# Altium schematic sheet PowerRails.SchDoc
size A4
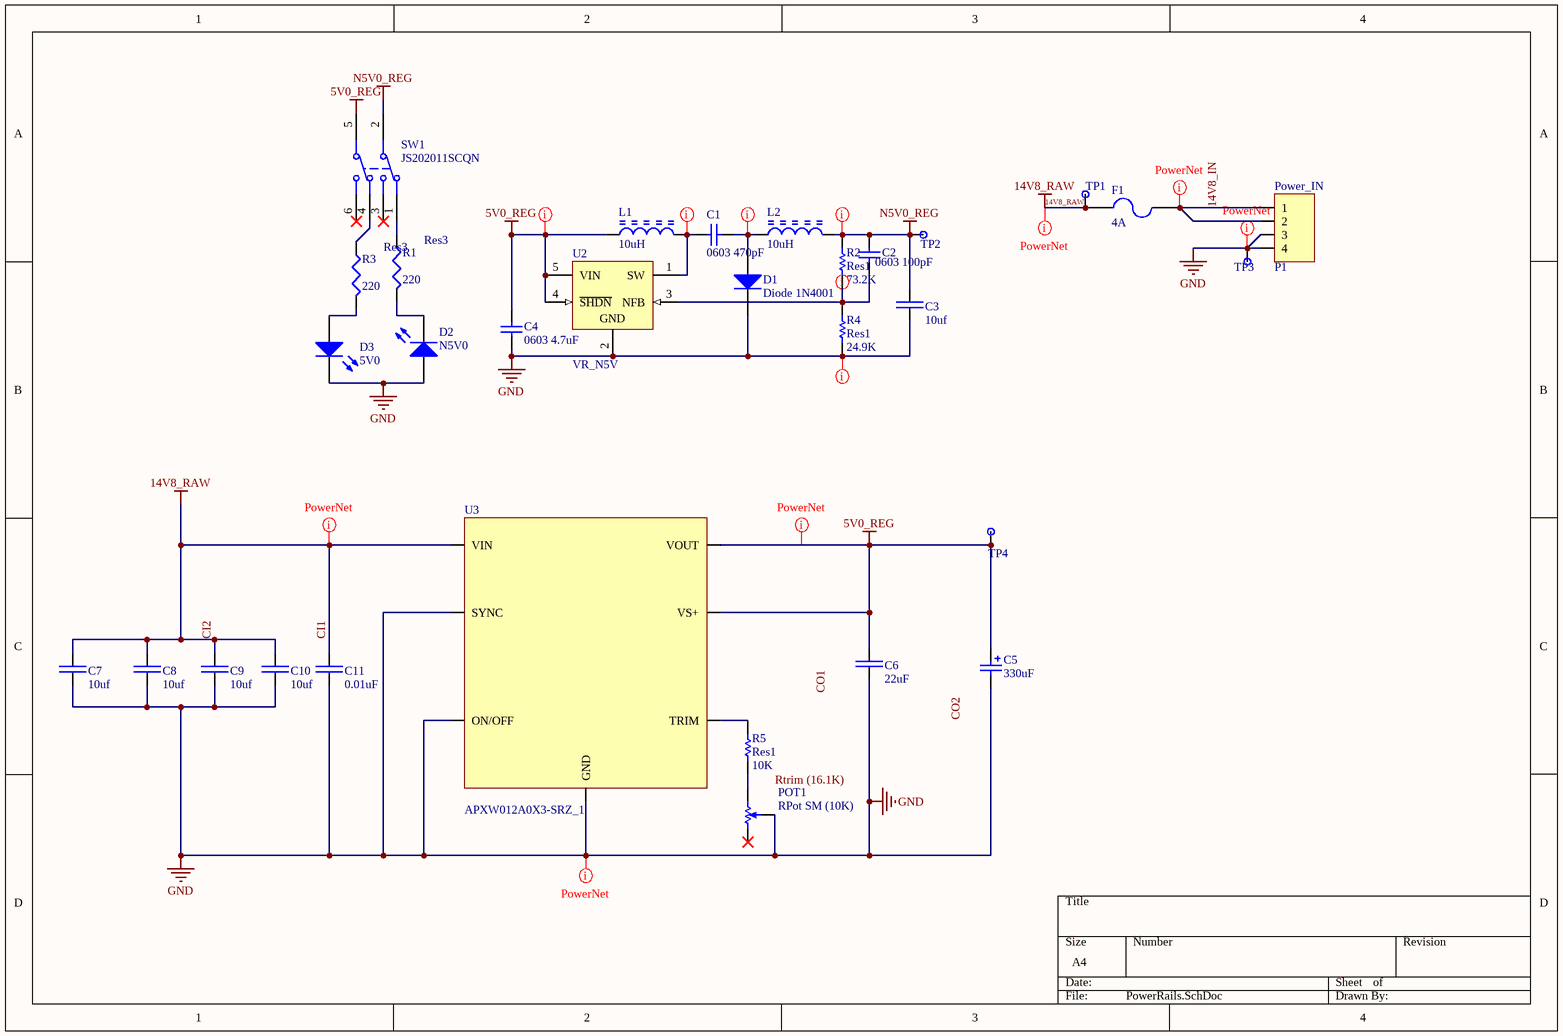
[diagram p0: PowerRails.SchDoc]

## Parts
C1  0603 470pF  [CAPC1608X90X35LL10T15]
C2  0603 100pF  [CAPC1608X90X35LL10T15]
C3  10uf  [10uF capacitor LPB]
C4  0603 4.7uF  [CAPC1608X90X35LL10T15]
C5  330uF  [330uF throught hole]
C6  22uF  [22uF Capacitor]
C7  10uf  [10uF capacitor LPB]
C8  10uf  [10uF capacitor LPB]
C9  10uf  [10uF capacitor LPB]
C10  10uf  [10uF capacitor LPB]
C11  0.01uF  [0.01uF capacitor]
D1  Diode 1N4001  [DO-41]
D2  N5V0  [LTST-C171TBKT]
D3  5V0  [LTST-C171TBKT]
F1  4A  [0157010.DR]
L1  10uH  [BOUR-CM322522_V]
L2  10uH  [BOUR-CM322522_V]
P1  Power_IN  [MOLEX 0039281043]
POT1  RPot SM (10K)  [POT4MM-2]
R1  Res3  value 220  [RESC1608X06N_0603]
R2  Res1  value 73.2K  [RESC1608X06N_0603]
R3  Res3  value 220  [RESC1608X06N_0603]
R4  Res1  value 24.9K  [RESC1608X06N_0603]
R5  Res1  value 10K  [RESC1608X06N_0603]
SW1  JS202011SCQN  [CKCP-JS202011SCQN-6_V]
TP1  5V0_REG  [50_MIL_PAD]  (value not drawn)
TP2  N5V0_REG  [50_MIL_PAD]  (value not drawn)
TP3  12V0_RAW  [50_MIL_PAD]  (value not drawn)
TP4  12V0_RAW  [50_MIL_PAD]  (value not drawn)
U2  VR_N5V  [LT-S5-5-SOT-23_L]
U3  APXW012A0X3-SRZ_1  [APXW012A0X3-SRZ]

## Nets
5V0_REG: C4.2 C5.1 C6.2 L1.1 SW1.5(COM) TP4.1 U2.4(~{SHDN}) U2.5(VIN) U3.3(VS+) U3.5(VOUT)
14V8_RAW: C7.2 C8.2 C9.2 C10.2 C11.2 F1.1 TP1.1 U3.7(VIN)  [also labelled CI1, CI2]
GND: C3.1 C4.1 C5.2 C6.1 C7.1 C8.1 C9.1 C10.1 C11.1 D1.2(K) D2.1(A) D3.2(K) P1.3 P1.4 POT1.W R4.1 TP3.1 U2.2(GND) U3.1(ON/OFF) U3.2(GND) U3.6(SYNC)
N5V0_REG: C2.2 C3.2 L2.2 R2.2 SW1.2(COM) TP2.1
14V8_IN: F1.2 P1.1 P1.2
NetC1_1: C1.1 L1.2 U2.1(SW)
NetC1_2: C1.2 D1.1(A) L2.1
NetC2_1: C2.1 R2.1 R4.2 U2.3(NFB)
NetD2_2: D2.2(K) R1.2
NetD3_1: D3.1(A) R3.2
NetPOT1_CW: POT1.CW(+) R5.1
NetR1_1: R1.1 SW1.1
NetR3_1: R3.1 SW1.4
NetR5_2: R5.2 U3.4(TRIM)

Not connected (* = marked no-connect by the designer): POT1 CCW(-)*; SW1 3* 6*

## Layout directives
net class PowerNet: 5V0_REG, 14V8_IN, 14V8_RAW, GND
rule Width Constraint [Pref Width = 15mil    Min Width = 15mil    Max Width = 15mil]: 5V0_REG, GND, N5V0_REG, NetC1_1, NetC1_2, NetC2_1

## Notes on the sheet
- Labels drawn without touching a wire or pin: CO1, CO2, Rtrim (16.1K)

## Library data of the parts
C1 C2 C4 = CMP-2006-02523-1: Part Number: GRM188R61E475KE11D; Manufacturer: Murata
C3 C7-C10 = GRT31CR61H106ME01L: CAP CER 10UF 50V X5R 1206; Manufacturer 1: Murata; Tolerance: 20%; Supplier 1: Digi-Key; Supplier Part Number 1: 490-12457-1-ND; Manufacturer Part Number 1: GRT31CR61H106ME01L; Stock 1: 8159; Pricing 1: 1=0,50000, 10=0,34900, 100=0,20920, 500=0,15690, 1000=0,13249 (USD); RoHS: Yes; Mount: Surface Mount; Case/Package: 1206; Case Code (Metric): 3216; Case Code (Imperial): 1206; Min Operating Temperature: -55°C; Max Operating Temperature: 85°C; Packaging: Tape and Reel; Capacitance: 10uF; Voltage Rating: 50V; Length: 0.126inch; Width: 0.063inch; Thickness: 0.071inch; Ratings: AEC-Q200; ComponentLink1URL: http://search.murata.co.jp/Ceramy/image/img/A01X/G101/ENG/GRT31CR61H106ME01-01.pdf?src-supplier=Digi-Key; ComponentLink1Description: http://search.murata.co.jp/Ceramy/image/img/A01X/G101/ENG/GRT31CR61H106ME01-01.pdf?src-supplier=Digi-Key; Category: Capacitor
C5 = 35ZLH330MEFCT810X12.5: CAP ALUM 330UF 20% 35V RADIAL; Manufacturer 1: Rubycon; Ripple Current: 731.5mA; Impedance: 39mR; Life (Hours): 10000Hour; Supplier 1: Digi-Key; Supplier Part Number 1: 1189-3752-1-ND; Manufacturer Part Number 1: 35ZLH330MEFCT810X12.5; Stock 1: 14330; Pricing 1: 1=0,52000, 10=0,36900, 100=0,24280 (USD); RoHS: Yes; Mount: Through Hole; Case/Package: Radial; Min Operating Temperature: -40°C; Max Operating Temperature: 105°C; Package Quantity: 1000; Capacitance: 330uF; Packaging: Tape and Reel; Tolerance: 20%; Voltage Rating: 35V; Lead Pitch: 0.197inch; Height - Seated (Max): 0.551inch; ComponentLink1URL: http://www.rubycon.co.jp/en/catalog/e_pdfs/aluminum/e_ZLH.pdf?src-supplier=Digi-Key; ComponentLink1Description: http://www.rubycon.co.jp/en/catalog/e_pdfs/aluminum/e_ZLH.pdf?src-supplier=Digi-Key; ComponentLink2URL: http://www.rubycon.co.jp/en/catalog/e_pdfs/aluminum/Radial_Lead_Alumi_Eng.pdf?src-supplier=Digi-Key; ComponentLink2Description: http://www.rubycon.co.jp/en/catalog/e_pdfs/aluminum/Radial_Lead_Alumi_Eng.pdf?src-supplier=Digi-Key
C6 = GRM32ER71E226KE15L: Cap Ceramic 22uF 25V X7R 10% SMD 1210 125C Embossed T/R; Manufacturer 1: Murata; Supplier 1: Digi-Key; Supplier Part Number 1: 490-5313-6-ND; Manufacturer Part Number 1: GRM32ER71E226KE15L; Stock 1: 52660; Pricing 1: 1=1,78000, 10=1,40600, 100=1,05410, 500=0,79646 (USD); RoHS: Yes; Mount: Surface Mount; Case/Package: 1210; Number of Pins: 2; Case Code (Metric): 3225; Case Code (Imperial): 1210; Material: Ceramic; Min Operating Temperature: -55°C; Max Operating Temperature: 125°C; Capacitance: 22uF; Tolerance: 10%; Dielectric: X7R; Voltage Rating: 25V; Packaging: Tape and Reel; Package Quantity: 1; Voltage Rating (DC): 25V; Termination: SMD/SMT; Voltage: 25V; Length: 3.2mm; Height: 2.5mm; Width: 0.098inch; Thickness: 0.106inch; Depth: 2.5mm; Radiation Hardening: No; REACH SVHC: No SVHC; Lead Free: Lead Free; ComponentLink1URL: https://datasheet.ciiva.com/6072/1697714-6072768.pdf?src-supplier=Farnell; ComponentLink1Description: https://datasheet.ciiva.com/6072/1697714-6072768.pdf?src-supplier=Farnell; ComponentLink2URL: https://datasheet.ciiva.com/16497/product-16497009.pdf?src-supplier=Future+Electronics; ComponentLink2Description: https://datasheet.ciiva.com/16497/product-16497009.pdf?src-supplier=Future+Electronics; ComponentLink3URL: https://datasheet.ciiva.com/3776/2741grm32er71e226ke1523-3776996.pdf?src-supplier=Arrow; ComponentLink3Description: https://datasheet.ciiva.com/3776/2741grm32er71e226ke1523-3776996.pdf?src-supplier=Arrow; ComponentLink4URL: https://datasheet.ciiva.com/11789/0900766b80ef921d-11789129.pdf?src-supplier=RSComponents; ComponentLink4Description: https://datasheet.ciiva.com/11789/0900766b80ef921d-11789129.pdf?src-supplier=RSComponents; ComponentLink5URL: https://datasheet.ciiva.com/29201/451826-da-01-de-vs-kondens-grm32-er71e-226ke15l-29201795.pdf?src-supplier=Conrad; ComponentLink5Description: https://datasheet.ciiva.com/29201/451826-da-01-de-vs-kondens-grm32-er71e-226ke15l-29201795.pdf?src-supplier=Conrad; ComponentLink6URL: https://datasheet.ciiva.com/175/partnumbering-e-01-175746.pdf?src-supplier=Digi-Key; ComponentLink6Description: https://datasheet.ciiva.com/175/partnumbering-e-01-175746.pdf?src-supplier=Digi-Key; ComponentLink7URL: https://datasheet.ciiva.com/175/partnumbering-e-01-175747.pdf?src-supplier=Digi-Key; ComponentLink7Description: https://datasheet.ciiva.com/175/partnumbering-e-01-175747.pdf?src-supplier=Digi-Key; ComponentLink8URL: https://datasheet.ciiva.com/175/partnumbering-e-01-175748.pdf?src-supplier=Digi-Key; ComponentLink8Description: https://datasheet.ciiva.com/175/partnumbering-e-01-175748.pdf?src-supplier=Digi-Key; ComponentLink9URL: https://datasheet.ciiva.com/22703/1697714-22703397.pdf?src-supplier=Element14; ComponentLink9Description: https://datasheet.ciiva.com/22703/1697714-22703397.pdf?src-supplier=Element14; Category: Capacitor
C11 = C0603C103KARACAUTO: Cap Ceramic 0.01uF 250V X7R 10% Pad SMD 0603 125C Automotive T/R; Manufacturer 1: KEMET; Capacitance: 10nF; Supplier 1: Digi-Key; Supplier Part Number 1: 399-17960-1-ND; Manufacturer Part Number 1: C0603C103KARACAUTO; Stock 1: 8483; Pricing 1: 1=0,90000, 10=0,68500, 100=0,49040, 500=0,37964, 1000=0,32691 (USD); RoHS: No; Mount: Surface Mount; Case/Package: 0603; Case Code (Imperial): 0603; Case Code (Metric): 1608; Min Operating Temperature: -55°C; Max Operating Temperature: 125°C; Packaging: Tape and Reel; Tolerance: 10%; Voltage Rating: 250V; Ratings: AEC-Q200; ComponentLink1URL: https://api.kemet.com/component-edge/download/datasheet/C0603C103KARACAUTO.pdf?src-supplier=Digi-Key; ComponentLink1Description: https://api.kemet.com/component-edge/download/datasheet/C0603C103KARACAUTO.pdf?src-supplier=Digi-Key; Category: Capacitor
D1 = Diode 1N4001: 1 Amp General Purpose Rectifier; Published: 8-Jun-2000; LatestRevisionDate: 17-Jul-2002; LatestRevisionNote: Re-released for DXP Platform.; DatasheetVersion: 1998; PackageVersion: Aug-1999; PackageReference: DO-41; Publisher: Altium Limited; PackageDescription: Diode, Axial; Body 5.2 x 2.7 mm (LxDia. max), Lead Dia. 0.86 mm (max); Code_JEDEC: DO-204-AL; ComponentLink1Description: Manufacturer Link; ComponentLink1URL: http://www.fairchildsemi.com/; ComponentLink2Description: Datasheet; ComponentLink2URL: http://www.fairchildsemi.com/ds/1N%2F1N4001.pdf
D2 D3 = Blue LED
F1 = Fuse 2: Fuse; Published: 8-Jun-2000; LatestRevisionDate: 17-Jul-2002; LatestRevisionNote: Re-released for DXP Platform.; PackageReference: PIN-W2/E2.8; Publisher: Altium Limited; PackageDescription: Thru-Hole; 2 Leads
L1 L2 = CMP-1747-00008-1: Chip Inductor / , 10 uH, +/- 10%, -40 to 125 degC, 1210 (3225 Metric), RoHS, Tape and Reel; Current Rating: 1.5 A; Colour: White; Gender: Female; Connector Type: USB; Min Operating Temperature: -55 degC; ComponentLink2Description: Datasheet; Packaging: Tray; Contact Material: Bronze; ComponentLink1Description: Manufacturer URL; PackageDescription: 2-Pin Surface Mount Device, Body 3.2 x 2.5 mm; Contact Plating: Gold; Max Operating Temperature: 85 degC; ComponentLink2URL: http://www.bourns.com/docs/Product-Datasheets/cm322522.pdf; PackageReference: 1210; Radiation Hardening: No; DatasheetVersion: Aug-14; Package Quantity: 100; Pins: 4; Mount: Through Hole; Lead Pitch: 2.5 mm; ComponentLink1URL: http://www.bourns.com/; Height: 15.9 mm; RoHSCompliant: true; Width: 11.15 mm
P1 = Molex 0039281043: Mini-Fit Jr. Header, Dual Row, Right-Angle, with Snap-in Plastic Peg PCB Lock, 6 Circuits, PA Polyamide Nylon 6/6 94V-2, 0.76µm Select Gold (Au) Plating
POT1 = RPot SM: Square Trimming Potentiometer; Published: 17-Dec-2003; DatasheetVersion: Oct-2003; PackageReference: POT4MM-2; Publisher: Altium Limited; PackageDescription: Square Trimming Potentiometer; ComponentLink1Description: Manufacturer Link; ComponentLink1URL: http://bourns.com/2/search.html
R1 R3 = Res3: Resistor; Published: 8-Jun-2000; LatestRevisionDate: 29-May-2009; LatestRevisionNote: IPC-7351 Footprint Added.; PackageReference: J1-0603; Publisher: Altium Limited; PackageDescription: Chip Resistor
R2 R4 R5 = Res1: Resistor; Published: 8-Jun-2000; LatestRevisionDate: 17-Jul-2002; LatestRevisionNote: Re-released for DXP Platform.; PackageReference: AXIAL-0.3; Publisher: Altium Limited; PackageDescription: Axial Device, Thru-Hole; 2 Leads; 0.3 in Pin Spacing
SW1 = CMP-2000-05087-1: Switch Slide DPDT, 0.3 A, 6 V, -40 to 85 degC, 6-Pin SMD, RoHS, Tape and Reel; Manufacturer: C&K Components; Contact Rating @ Voltage: 0.3@6VDCA; COO: US; Maximum DC Voltage Rating: 6V; Minimum Insulation Resistance: 100MOhm; Actuator Color: Black; Body Orientation: Straight; Actuator Material: Nylon4/6; Dielectric Strength: 500VAC; Maximum Contact Resistance: 70mOhm; Actuator Style: TopSlide; Electrical Life: 15000Cycles; Seal Location: N/A; Base Material: N/A; Mechanical Life: N/A; Switch Configuration: N/A; HTS: 8536509050; Contact Material: CopperAlloy; Supplier Standard Pack: 5,000; Manufacturer URL: http://www.ckswitches.com; Supplier: C&KComponents; Datasheet URL: http://datasheet.octopart.com/JS202011SCQN-C%26K-Components-datasheet-62100994.pdf; Housing Material: Nylon4/6; Product Weight: N/A; Dimension: 9x7.5x5.5mm; Maximum AC Voltage Rating: N/A; ECCN: EAR99; Contact Plating: Silver; Pole Throw Configuration: DPDT; Packaging: TapeandReel; Part No: JS202011SCQN; Datasheet Version: Sep-15; Seal Description: N/A; RoHS: Yes; Mounting: SurfaceMount,GullWing; Family: JS; Type: Sub-Miniature; Operating Temperature: -40to85C
TP1-TP4 = TestPt
U2 = CMP-0491-01503-1: Micropower Inverting DC/DC Converter, 5-pin SOT23 (S5-5), -40 to 85 degC, Pb-Free, Mini Tape and Reel; PartNumber: LT1617ES5#TRMPBF; Manufacturer: Linear Technology; Number of Outputs: 1; RoHS: TRUE; ComponentLink3URL: http://cds.linear.com/docs/en/datasheet/17278fb.pdf; ComponentLink2Description: Datasheet; Packing: Mini Tape and Reel; PackageReference: S5-5; ComponentLink1URL: http://www.linear.com/; Mounting Technology: Surface Mount; PackageDescription: 5-Pin Plastic SOT-23, Body 1.625 x 2.90 mm, Pitch 0.95 mm; ComponentLink3Description: Package Specification; ComponentLink2URL: http://cds.linear.com/docs/en/datasheet/16171f.pdf; PackageVersion: Aug-07; ComponentLink1Description: Manufacturer URL
U3 = APXW012A0X3-SRZ_1: DC DC CONVERTER 3-18V 12A; Manufacturer 1: GE; Number of Outputs: 1; Min Input Voltage: 9V; Max Input Voltage: 36V; Voltage - Output 1: 18V; Efficiency: 95.5%; Supplier 1: Avnet; Supplier Part Number 1: 150028492; Manufacturer Part Number 1: APXW012A0X3-SRZ; Stock 1: 0; RoHS: Yes; Mount: Surface Mount; Case/Package: Module; Number of Pins: 9; Min Operating Temperature: -40°C; Max Operating Temperature: 85°C; Packaging: Tape and Reel; Max Output Current: 12A; Current - Output 1: 12A; Package Quantity: 140; Output Current: 12A; Output Voltage: 18V; Features: OCP,OTP; Length: 1.3inch; Height: 0.39inch; Width: 0.53inch; ComponentLink1URL: http://apps.geindustrial.com/publibrary/checkout/DS-APXW012?TNR=Data%20Sheets&src-supplier=Avnet; ComponentLink1Description: http://apps.geindustrial.com/publibrary/checkout/DS-APXW012?TNR=Data%20Sheets&src-supplier=Avnet; ComponentLink2URL: http://apps.geindustrial.com/publibrary/checkout/DS-APXW012?TNR=Data%20Sheets|DS-APXW012|generic&src-supplier=Digi-Key; ComponentLink2Description: http://apps.geindustrial.com/publibrary/checkout/DS-APXW012?TNR=Data%20Sheets|DS-APXW012|generic&src-supplier=Digi-Key; ComponentLink3URL: http://apps.geindustrial.com/publibrary/checkout/DS-APXW012?TNR=Data%20Sheets%7CDS-APXW012%7Cgeneric&src-supplier=Mouser; ComponentLink3Description: http://apps.geindustrial.com/publibrary/checkout/DS-APXW012?TNR=Data%20Sheets%7CDS-APXW012%7Cgeneric&src-supplier=Mouser; Category: Buck Converter